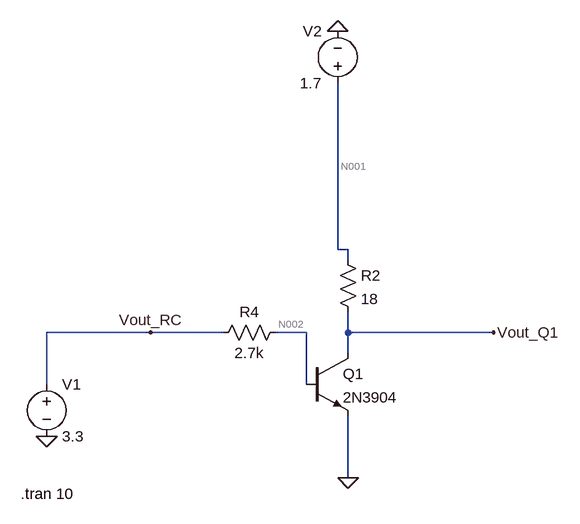
[diagram p0: schematic emitter simulation.asc]
emitter simulation.asc, the LTspice schematic file:
Version 4
SHEET 1 1612 680
WIRE 832 -112 832 -368
WIRE 848 -112 832 -112
WIRE 848 -96 848 -112
WIRE 544 16 384 16
WIRE 656 16 544 16
WIRE 784 16 736 16
WIRE 848 16 848 -16
WIRE 1072 16 848 16
WIRE 848 48 848 16
WIRE 384 96 384 16
WIRE 784 96 784 16
WIRE 848 240 848 144
FLAG 848 240 0
FLAG 832 -448 0
FLAG 1072 16 Vout_Q1
FLAG 544 16 Vout_RC
FLAG 384 176 0
SYMBOL npn 784 48 R0
SYMATTR InstName Q1
SYMATTR Value 2N3904
SYMBOL res 832 -112 R0
SYMATTR InstName R2
SYMATTR Value 18
SYMBOL voltage 832 -352 R180
WINDOW 0 24 96 Left 2
WINDOW 3 24 16 Left 2
WINDOW 123 0 0 Left 0
WINDOW 39 0 0 Left 0
SYMATTR InstName V2
SYMATTR Value 1.7
SYMBOL res 752 0 R90
WINDOW 0 0 56 VBottom 2
WINDOW 3 32 56 VTop 2
SYMATTR InstName R4
SYMATTR Value 2.7k
SYMBOL voltage 384 80 R0
WINDOW 123 0 0 Left 0
WINDOW 39 0 0 Left 0
SYMATTR InstName V1
SYMATTR Value 3.3
TEXT 344 264 Left 2 !.tran 10

The netlist it stands for:
* emitter simulation.asc
Q1 Vout_Q1 N002 0 0 2N3904
R2 N001 Vout_Q1 18
V2 N001 0 1.7
R4 N002 Vout_RC 2.7k
V1 Vout_RC 0 3.3
.model NPN NPN
.model PNP PNP
.lib standard.bjt
.tran 10
.backanno
.end

* Results of the author's LTspice run, read from the files saved beside the schematic
* Operating Point, zero values left out:
*   V(vout_q1) = 119 mV
*   V(n002) = 804.4 mV
*   V(n001) = 1.7 V
*   V(vout_rc) = 3.3 V
*   Ic(Q1) = 87.83 mA
*   Ib(Q1) = 924.3 µA
*   Ie(Q1) = -88.76 mA
*   I(R2) = 87.83 mA
*   I(R4) = -924.3 µA
*   I(V2) = -87.83 mA
*   I(V1) = -924.3 µA